# Altium schematic sheet Microcontroller.SchDoc
size A; SheetNumber: 5; SheetTotal: 5
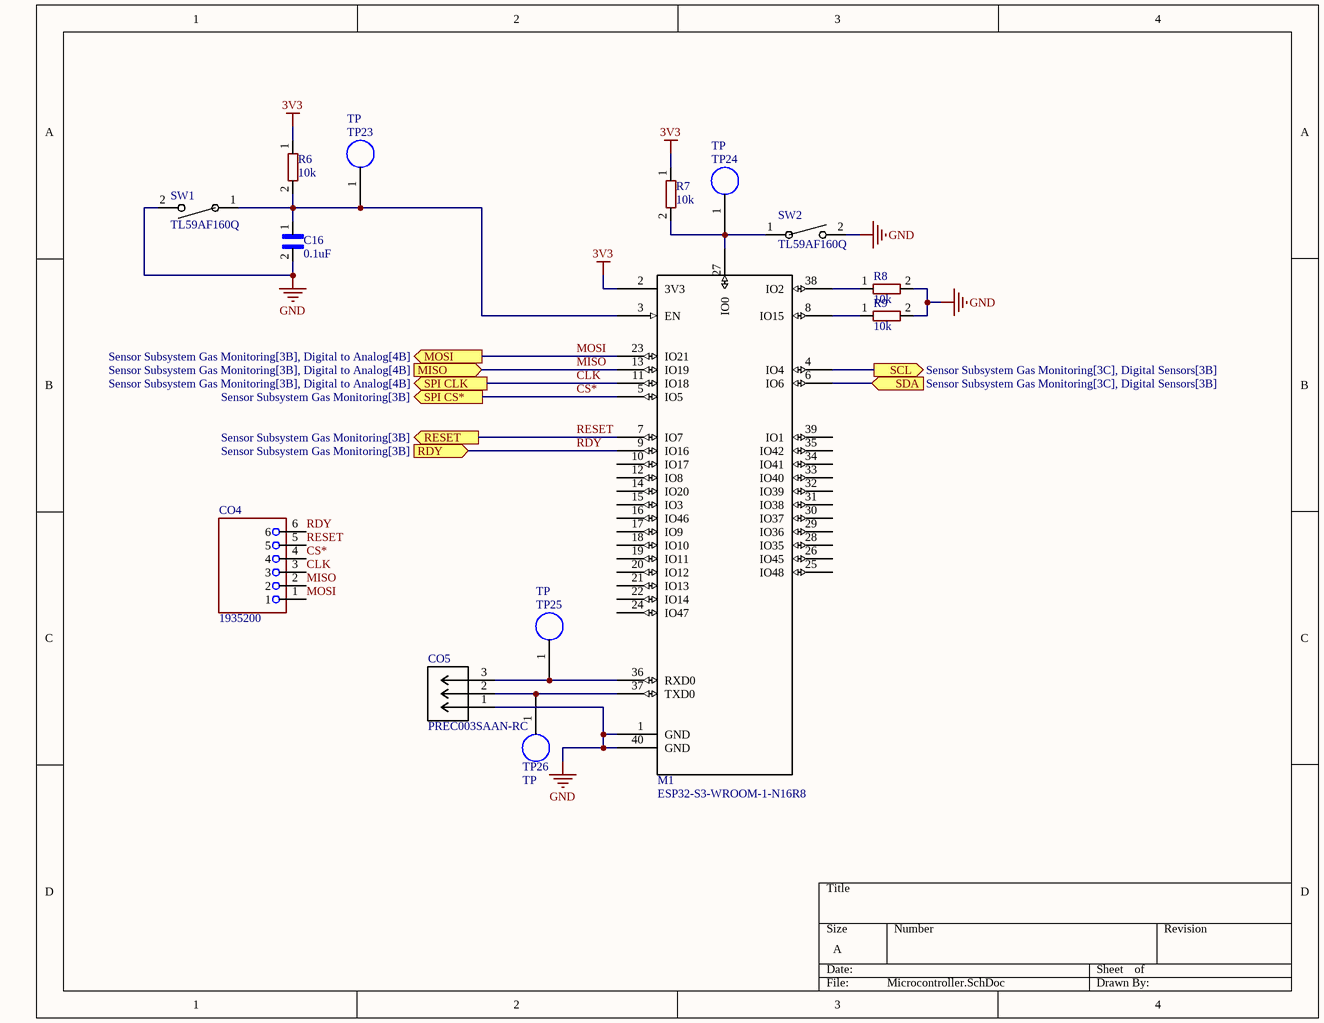
[diagram p0: Microcontroller.SchDoc]

## Parts
C16  0.1uF  [0.1uF Capacitor]
CO4  1935200  [PHOENIX_1935200]
CO5  PREC003SAAN-RC  [CONN_PREC003SAAN-RC_SUL]
M1  ESP32-S3-WROOM-1-N16R8  [ESP32-S3-WROOM-1_EXP]
R6  10k  [0603]
R7  10k  [0603]
R8  10k  [0603]
R9  10k  [0603]
SW1  TL59AF160Q  [SW_TL59AF160Q_EWI]
SW2  TL59AF160Q  [SW_TL59AF160Q_EWI]
TP23  TP  [TestPoint]  (no BOM)
TP24  TP  [TestPoint]  (no BOM)
TP25  TP  [TestPoint]  (no BOM)
TP26  TP  [TestPoint]  (no BOM)

## Ports
MISO (in, see Sensor Subsystem Gas Monitoring[3B], Digital to Analog[4B]), MOSI (out, see Sensor Subsystem Gas Monitoring[3B], Digital to Analog[4B]), RDY (in, see Sensor Subsystem Gas Monitoring[3B]), RESET (out, see Sensor Subsystem Gas Monitoring[3B]), SCL (out, see Sensor Subsystem Gas Monitoring[3C], Digital Sensors[3B]), SDA (in, see Sensor Subsystem Gas Monitoring[3C], Digital Sensors[3B]), SPI CLK (out, see Sensor Subsystem Gas Monitoring[3B], Digital to Analog[4B]), SPI CS* (out, see Sensor Subsystem Gas Monitoring[3B])

## Nets
3V3: M1.2(3V3) R6.1 R7.1
GND: C16.2 CO5.1 M1.1(GND) M1.40(GND) R8.2 R9.2 SW1.2 SW2.2
CLK: CO4.3 M1.11(IO18) ; port SPI CLK
CS*: CO4.4 M1.5(IO5) ; port SPI CS*
MISO: CO4.2 M1.13(IO19) ; port MISO
MOSI: CO4.1 M1.23(IO21) ; port MOSI
RDY: CO4.6 M1.9(IO16) ; port RDY
RESET: CO4.5 M1.7(IO7) ; port RESET
SCL: M1.4(IO4) ; port SCL
SDA: M1.6(IO6) ; port SDA
NetC16_1: C16.1 M1.3(EN) R6.2 SW1.1 TP23.1
NetCO5_2: CO5.2 M1.37(TXD0) TP26.1
NetCO5_3: CO5.3 M1.36(RXD0) TP25.1
NetM1_8: M1.8(IO15) R9.1
NetM1_27: M1.27(IO0) R7.2 SW2.1 TP24.1
NetM1_38: M1.38(IO2) R8.1

Not connected (* = marked no-connect by the designer): M1 10(IO17) 12(IO8) 14(IO20) 15(IO3) 16(IO46) 17(IO9) 18(IO10) 19(IO11) 20(IO12) 21(IO13) 22(IO14) 24(IO47) 25(IO48) 26(IO45) 28(IO35) 29(IO36) 30(IO37) 31(IO38) 32(IO39) 33(IO40) 34(IO41) 35(IO42) 39(IO1)

## Library data of the parts
C16 = CC1206JRX7R9BB104: No Description Available; Mfr_Name: Yageo
CO4 = 1935200: PCB terminal block - nominal current: 17.5 A - rated voltage (III/2): 400 V - nominal cross section: 1.5 mm² - pitch: 5 mm - number of positions: 6 - connection method: Screw connection with wire protector - mounting: Wave soldering - conductor/PCB connection direction: 0 ° - color: green - Pin layout: Linear pinning - Solder pin [P]: 3.5 mm; MF: Littelfuse; SnapEDA_Link: https://www.snapeda.com/parts/1935200/Littelfuse/view-part/?ref=snap; Package: None; Value: *; MP: 1935200; Check_prices: https://www.snapeda.com/parts/1935200/Littelfuse/view-part/?ref=eda
CO5 = PREC003SAAN-RC: No Description Available; Mfr_Name: Sullins; RefDes: RefDes; Type: Type
M1 = ESP32-S3-WROOM-1-N16R8: No Description Available; Mfr_Name: Espressif Systems; RefDes: RefDes; Type: Type
R6-R9 = RC0603FR-1310KL: http://octopart.com/rc0603fr-1310kl-yageo+%2F+phycomp-25905087; Package: None; Price: None; Value: *; MP: RC0603FR-1310KL; Availability: Unavailable
SW1 SW2 = TL59AF160Q: No Description Available; Mfr_Name: E-Switch
TP23-TP26 = TestPoint: Test point for voltage, current, ect.